# EAGLE design iGlass v2 (EAGLE 9.6.2)
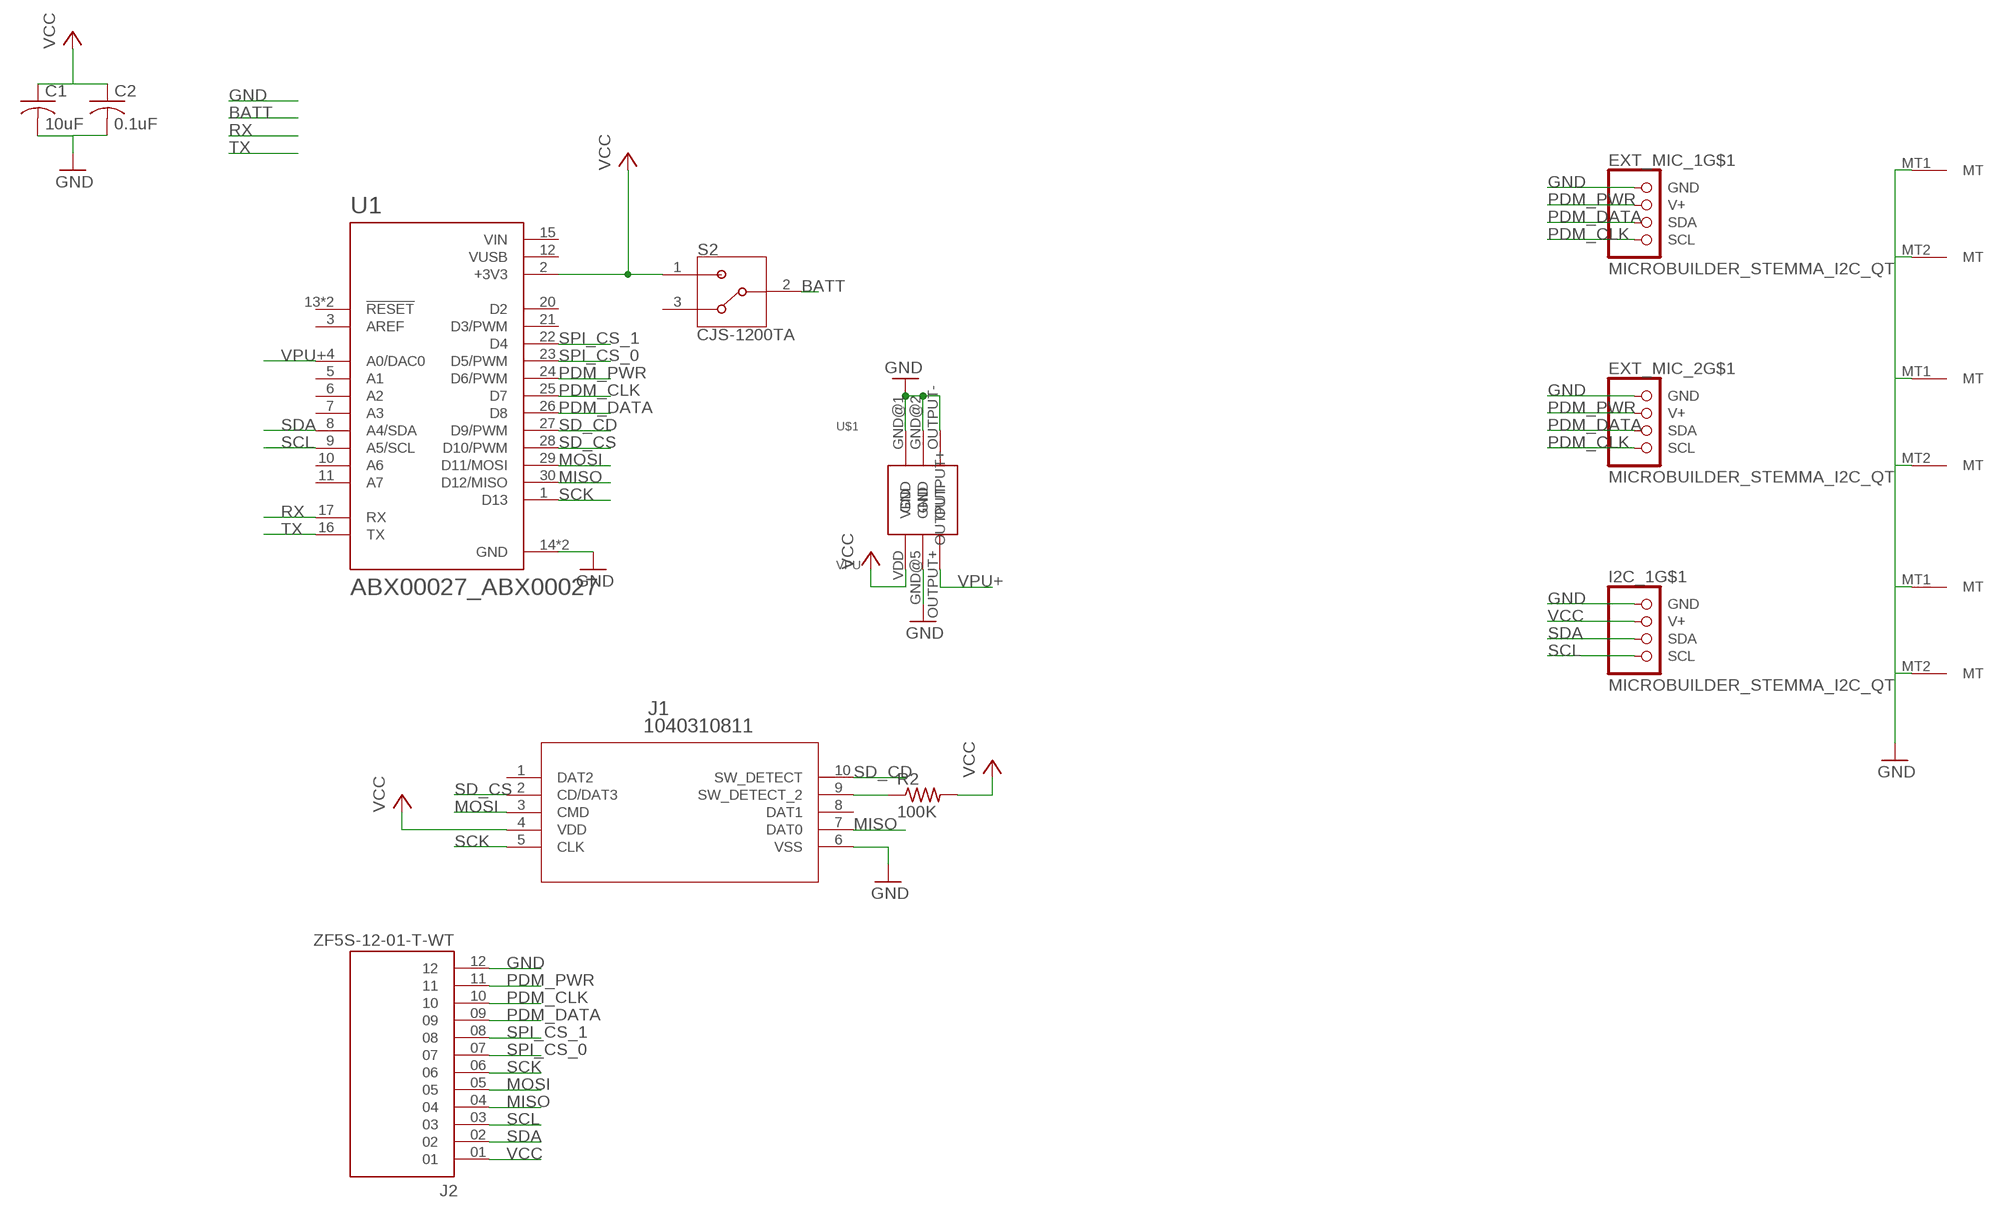
[diagram p0: schematic, sheet 1]

## Parts
C1  10uF  C-USC0805  [C0805]
C2  0.1uF  C-USC0805  [C0805]
EXT_MIC_1  MICROBUILDER_STEMMA_I2C_QT  [MICROBUILDER_JST_SH4]
EXT_MIC_2  MICROBUILDER_STEMMA_I2C_QT  [MICROBUILDER_JST_SH4]
I2C_1  MICROBUILDER_STEMMA_I2C_QT  [MICROBUILDER_JST_SH4]
J1  1040310811  [104031-0811_MOL]
J2  ZF5S-12-01-T-WT  [SAMTEC_ZF5S-12-01-T-WT]
R2  100K  R-US_R0805  [R0805]
S2  CJS-1200TA  [SW_CJS-1200TA]
U1  ABX00027_ABX00027  [ABX00027_MODULE_ABX00027]
U$1  VPU  [VPU]

## Nets
BATT: S2.2
GND: C1.2 C2.2 EXT_MIC_1.1(GND) EXT_MIC_1.MT1(MT) EXT_MIC_1.MT2(MT) EXT_MIC_2.1(GND) EXT_MIC_2.MT1(MT) EXT_MIC_2.MT2(MT) I2C_1.1(GND) I2C_1.MT1(MT) I2C_1.MT2(MT) J1.6(VSS) J2.12 U1.14(GND) U1.19(GND) U$1.GND@1(GND) U$1.GND@2(GND) U$1.GND@5(GND) U$1.OUTPUT-
MISO: J1.7(DAT0) J2.04 U1.30(D12/MISO)
MOSI: J1.3(CMD) J2.05 U1.29(D11/MOSI)
N$3: J1.9(SW_DETECT_2) R2.1
PDM_CLK: EXT_MIC_1.4(SCL) EXT_MIC_2.4(SCL) J2.10 U1.25(D7)
PDM_DATA: EXT_MIC_1.3(SDA) EXT_MIC_2.3(SDA) J2.09 U1.26(D8)
PDM_PWR: EXT_MIC_1.2(V+) EXT_MIC_2.2(V+) J2.11 U1.24(D6/PWM)
RX: U1.17(RX)
SCK: J1.5(CLK) J2.06 U1.1(D13)
SCL: I2C_1.4(SCL) J2.03 U1.9(A5/SCL)
SD_CD: J1.10(SW_DETECT) U1.27(D9/PWM)
SD_CS: J1.2(CD/DAT3) U1.28(D10/PWM)
SDA: I2C_1.3(SDA) J2.02 U1.8(A4/SDA)
SPI_CS_0: J2.07 U1.23(D5/PWM)
SPI_CS_1: J2.08 U1.22(D4)
TX: U1.16(TX)
VCC: C1.1 C2.1 I2C_1.2(V+) J1.4(VDD) J2.01 R2.2 S2.1 U1.2(+3V3) U$1.VDD
VPU+: U1.4(A0/DAC0) U$1.OUTPUT+
Unconnected: J1.1(DAT2) J1.8(DAT1) S2.3 U1.3(AREF) U1.5(A1) U1.6(A2) U1.7(A3) U1.10(A6) U1.11(A7) U1.13(!RESET) U1.18(!RESET) U1.20(D2) U1.21(D3/PWM)

## Power pins joined to a net without a drawn wire
VIN: U1.15(VIN)
VUSB: U1.12(VUSB)

## Library data of the parts
C1 C2 = rcl:C-US: CAPACITOR, American symbol
EXT_MIC_1 EXT_MIC_2 I2C_1 = smart-glasses:MICROBUILDER_STEMMA_I2C
J1 = micro_sd_slot:1040310811; COPYRIGHT: Copyright (C) 2021 Ultra Librarian. All rights reserved.; MANUFACTURER_PART_NUMBER: 1040310811; MFR_NAME: Molex Connector Corporation
J2 = ZF5S-12-01-T-WT:ZF5S-12-01-T-WT; MANUFACTURER: SAMTEC
R2 = resistor:R-US_: RESISTOR, American symbol
S2 = CJS-1200TA:CJS-1200TA: Switch Slide N.O./N.C. SPDT Raised Slide 0.1A 24VDC J-Hook SMD Embossed T/R Check availability <https://pricing.snapeda.com/parts/CJS-1200TA/Nidec%20Copal/view-part?ref=eda>; AVAILABILITY: In Stock; DESCRIPTION: Slide Switch SPDT Surface Mount; MF: Nidec Copal; MP: CJS-1200TA; PACKAGE: None; PRICE: None; PURCHASE-URL: https://pricing.snapeda.com/search/part/CJS-1200TA/?ref=eda
U1 = smart-glasses:ABX00027_ABX00027: ATSAMD21G18A Arduino Nano 33 IoT SAM D ARM® Cortex®-M0+ MCU 32-Bit Embedded Evaluation Board Check prices <https://pricing.snapeda.com/parts/ABX00027/Arduino/view-part?ref=eda>; AVAILABILITY: In Stock; DESCRIPTION: ATSAMD21G18A Arduino Nano 33 IoT SAM D ARM® Cortex®-M0+ MCU 32-Bit Embedded Evaluation Board; MF: Arduino; MP: ABX00027; PACKAGE: None; PRICE: None; PURCHASE-URL: https://pricing.snapeda.com/search/part/ABX00027/?ref=eda
U$1 = VPU:VPU

## Board
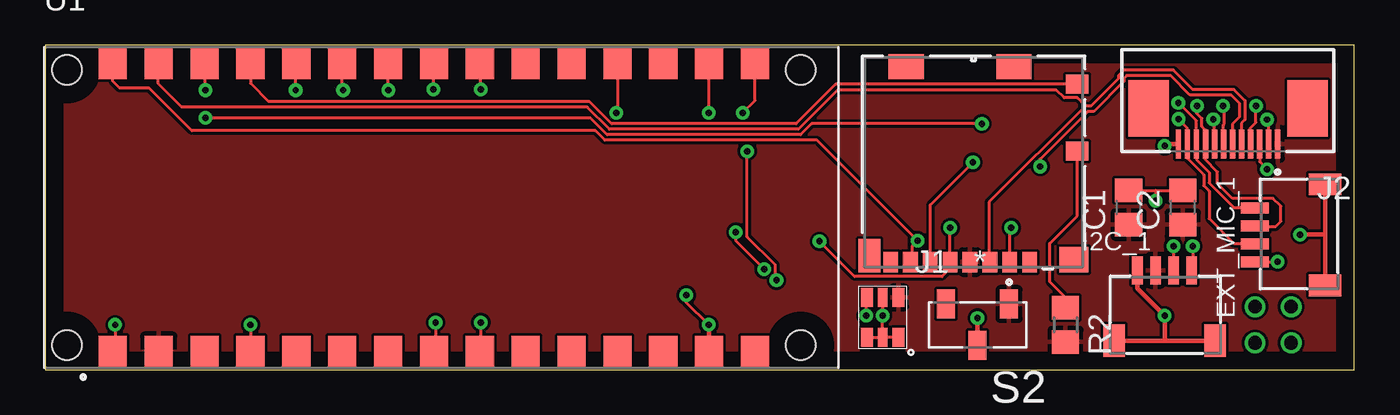
[diagram p1: board, top side]
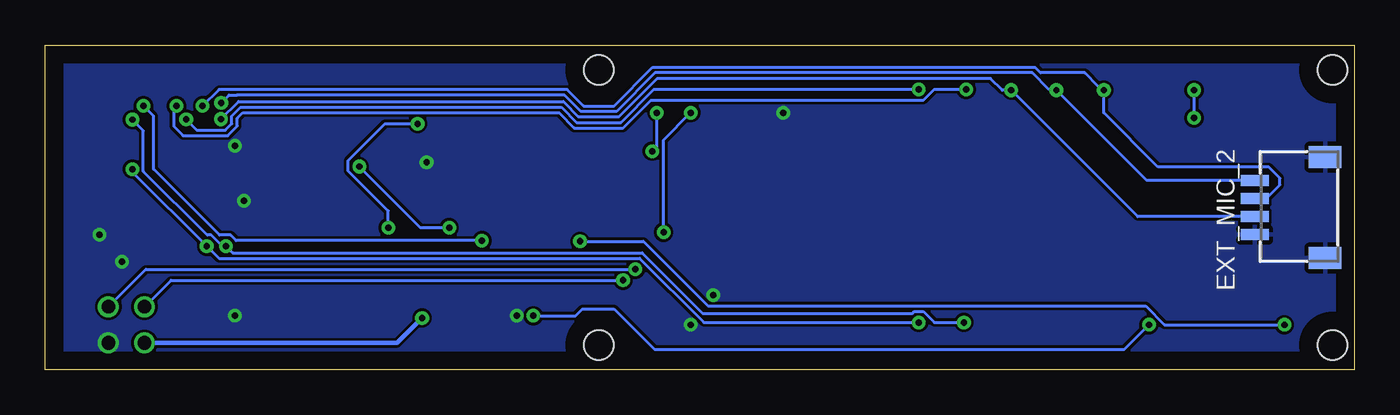
[diagram p2: board, bottom side, seen from below]

Size 72.5 x 18 mm. Coordinates in mm from the lower left corner, seen from the top.
Outline: 0,0 72.5,0 72.5,18 0,18 0,0
Copper layers (1*16): Top 0.035mm / dielectric 1.5mm / Bottom 0.035mm
Design rules "default": minimum track width 6mil, minimum drill 0.35mm, track to track 6mil, track to pad 6mil, pad to pad 6mil, via to via 6mil, smd to smd 6mil, copper to edge 40mil, drill to drill 6mil, minimum pad ring 10mil, minimum via ring 8mil, stop-mask expansion 4mil, vias tented up to drill 0mil, thermal gap 10mil

### Footprints (pad centres in the part's own frame; a part is rotated, then mirrored left to right if it is on the bottom)
C0805 = smd 1.3 x 1.5: 1 -0.95,0; 2 0.95,0
MICROBUILDER_JST_SH4 = smd 0.6 x 1.55: 1 -1.5,2.514; 2 -0.5,2.514; 3 0.5,2.514; 4 1.5,2.514 | smd 1.2 x 1.8: MT1 -2.8,-1.386; MT2 2.8,-1.386
104031-0811_MOL = smd 0.813 x 1.143: 1 3.105,-5.521; 2 2.005,-5.521; 3 0.905,-5.521; 4 -0.195,-5.521; 5 -1.295,-5.521; 6 -2.395,-5.521; 7 -3.495,-5.521; 8 -4.595,-5.521 | smd 1.245 x 1.041: 9 5.74,0.628; 10 5.74,4.329 | smd 1.6 x 1.397: 11 5.565,-5.396 | smd 1.219 x 1.854: 12 -5.755,-5.171 | smd 1.956 x 1.397: 13 -3.73,5.303; 14 2.24,5.303
SAMTEC_ZF5S-12-01-T-WT = smd 0.3 x 1.6: 01 -2.75,1.98; 02 -2.25,1.98; 03 -1.75,1.98; 04 -1.25,1.98; 05 -0.75,1.98; 06 -0.25,1.98; 07 0.25,1.98; 08 0.75,1.98; 09 1.25,1.98; 10 1.75,1.98; 11 2.25,1.98; 12 2.75,1.98 | smd 2.24 x 3.12: S1 -4.397,0; S2 4.397,0
R0805 = smd 1.3 x 1.5: 1 -0.95,0; 2 0.95,0
SW_CJS-1200TA = smd 1 x 1.6: 1 -1.75,-1.15; 2 0,1.15; 3 1.75,-1.15
ABX00027_MODULE_ABX00027 = smd 1.56 x 1.75: 1 -18.19,-8; 2 -15.65,-8; 3 -13.11,-8; 4 -10.57,-8; 5 -8.03,-8; 6 -5.49,-8; 7 -2.95,-8; 8 -0.41,-8; 9 2.13,-8; 10 4.67,-8; 11 7.21,-8; 12 9.75,-8; 13 12.29,-8; 14 14.83,-8; 15 17.37,-8; 16 17.37,8; 17 14.83,8; 18 12.29,8; 19 9.75,8; 20 7.21,8; 21 4.67,8; 22 2.13,8; 23 -0.41,8; 24 -2.95,8; 25 -5.49,8; 26 -8.03,8; 27 -10.57,8; 28 -13.11,8; 29 -15.65,8; 30 -18.19,8 | hole 1.651: -20.73,-7.62; -20.73,7.62; 19.91,7.62; 19.91,-7.62
VPU = smd 0.662 x 1.03: GND@1 -0.884,1.105; OUTPUT+ 0.884,-1.105; OUTPUT- 0.884,1.105; VDD -0.884,-1.105 | smd 0.533 x 1.03: GND@2 0,1.105; GND@5 0,-1.105

### Placement (x,y rotation side)
C1  60,9 90 top
C2  63,9 90 top
EXT_MIC_1  69.5,7.48 90 top
EXT_MIC_2  3,9 90 bottom
I2C_1  61.99,3 0 top
J1  51.41,11.5 0 top
J2  65.5,14.5 180 top
R2  56.5,2.5 270 top
S2  51.63,2.5 180 top
U1  21.94,9 0 top
U$1  46.38,2.91 180 top

### Tracks (layer width: path | path; a pad name or v marks a point on that pad's centre or on a via)
BATT  (via drill 0.35, 0.75)
  Top 0.254: v51.62,2.88 S2.2
  Bottom 0.254: v67,1.5 53,1.5 v51.62,2.88
GND  (via drill 0.35, 0.75)
  Top 0.152: C1.2 61.5,9.95 | 61.5,9.95 C2.2 | 61.5,9.95 v61.5,9.38 | J1.6 49.02,9.14 v51.38,11.5 | U1.19 31.69,14.31 v31.62,14.25 | U$1.GND@5 v46.38,3 | v46.38,3 | U$1.OUTPUT- U$1.GND@2 | U$1.GND@1 U$1.GND@2 | U$1.GND@2 v46.38,3 | v36.75,2.5 35.5,3.75 v35.5,4.14 | EXT_MIC_1.1 68.23,5.98 v68.25,6
  Top 0.254: U1.14 36.77,2.48 v36.75,2.5 | I2C_1.MT1 62.12,1.61 | 62.12,1.61 I2C_1.MT2 | 62.12,1.61 62,1.74 v62,3 60.49,4.51 I2C_1.1 | EXT_MIC_1.MT2 70.89,7.5 | 70.89,7.5 EXT_MIC_1.MT1 | 70.89,7.5 v69.5,7.5 | J2.12 62.11,12.52 v62,12.41
  other vias: 69,1.5
  pour Bottom: -0.5,18.5 -0.5,-0.5 73,-0.5 73,18.5
MISO  (via drill 0.35)
  Top 0.152: v67.06,14.63 67.06,13.72 66.75,13.41 66.75,12.65 J2.04 | J1.7 48.01,6.1 48.01,6.86 v48.31,7.16 42.74,12.73 31,12.73 30.47,13.25 8.12,13.25 5.75,15.62 4.12,15.62 3.75,16 3.75,16.91
  Bottom 0.152: v67.06,14.63 66.5,14.07 66.5,11.12 62.84,7.46 62.23,7.46 61.93,7.16 v48.31,7.16
MOSI
  Top 0.152: 57.61,14.63 52.27,9.3 52.27,6.1 J1.3 | 57.61,14.63 57.91,14.63 59.44,16.15 59.44,16.31 59.74,16.61 62.48,16.61 63.55,15.54 65.84,15.54 66.45,14.94 66.45,13.87 66.25,13.67 J2.05 66.29,12.65 | 57.61,14.63 57.16,15.08 56.43,15.08 56.01,15.5 43.87,15.5 41.71,13.34 31.25,13.34 30.02,14.57 7.55,14.57 6.25,15.88 6.25,16.87 6.29,16.91
N$3
  Top 0.152: J1.9 57.15,8.53 55.63,7.01 55.63,4.88 56.39,4.12 56.39,3.5 R2.1
PDM_CLK  (via drill 0.35)
  Top 0.152: v16.5,15.5 16.45,15.55 16.45,16.91 | EXT_MIC_1.4 66.9,8.99 65.84,8.99 64.47,10.36 64.47,10.95 63.75,11.66 J2.10 63.75,13.81 v62.75,14.8
  Bottom 0.152: EXT_MIC_2.4 11.5,10.5 v16.5,15.5 16.61,15.54 16.92,15.54 17.83,16.46 38.73,16.46 40.87,14.33 42.82,14.33 43.74,15.24 61.88,15.24 62.32,15.24 v62.75,14.8
PDM_DATA  (via drill 0.35)
  Top 0.152: v13.88,15.5 13.88,16.87 13.91,16.91 | EXT_MIC_1.3 67.06,7.92 68.12,7.92 68.43,8.23 68.43,9.07 67.99,9.51 65.75,9.51 64.92,10.34 64.92,10.97 64.25,11.64 J2.09 | 64.31,12.5 J2.09 | J2.09 64.25,13.29 64.06,13.49 64.06,13.93 63.78,14.21 v63.78,14.63
  Bottom 0.152: EXT_MIC_2.3 4.88,9.5 4.12,10.25 4.12,10.62 4.75,11.25 10.88,11.25 13.88,14.25 v13.88,15.5 13.87,15.54 14.02,15.7 14.17,15.7 14.94,16.46 17.37,16.46 17.68,16.76 38.86,16.76 40.99,14.63 42.67,14.63 43.59,15.54 62.87,15.54 v63.78,14.63
PDM_PWR  (via drill 0.35)
  Top 0.152: v19,15.5 19,16.9 18.99,16.91 | EXT_MIC_1.2 66.9,7.01 65.84,7.01 64.47,8.38 64.47,9.91 64.16,10.21 64.16,10.82 63.25,11.73 63.25,12.5 J2.11 63.25,13.41 v62.77,13.89
  Bottom 0.152: EXT_MIC_2.2 12,8.5 v19,15.5 19.5,15.5 20.15,16.15 38.61,16.15 40.74,14.02 42.95,14.02 43.8,14.88 61.79,14.88 v62.77,13.89
RX  (via drill 0.35, 0.75)
  Top 0.152: v39.82,5.57 38.25,7.15 v38.25,7.62 | v36.75,14.25 36.75,16.89 36.77,16.91
  Bottom 0.152: v69,3.5 66.93,5.57 v39.82,5.57 | v38.25,7.62 38.25,12.75 v36.75,14.25
SCK  (via drill 0.35)
  Top 0.152: 65.84,12.65 J2.06 65.75,13.63 66.14,14.02 66.14,14.78 65.68,15.24 63.4,15.24 62.33,16.31 59.89,16.31 59.74,16.15 59.74,16 58.06,14.33 57.73,14.33 55.1,11.7 v55.1,11.27 | v50.12,7.88 50.12,7.87 J1.5 50.12,5.62 49.67,5.17 44.83,5.17 v42.88,7.12 | v3.88,2.5 3.88,1.22 3.75,1.09
  Bottom 0.152: v50.12,7.88 51.71,7.88 v55.1,11.27 | v42.88,7.12 39.38,7.12 35.79,3.54 11.55,3.54 10.52,2.5 v3.88,2.5
SCL  (via drill 0.35)
  Top 0.152: v63.55,6.86 63.55,5.64 I2C_1.4 | 67.21,12.5 J2.03 67.25,11.54 v67.67,11.12 | v24.12,2.62 24.12,1.15 24.07,1.09
  Bottom 0.152: v67.67,11.12 67.67,10.97 v63.55,6.86 62.87,6.18 39.57,6.18 36.02,2.62 v24.12,2.62
SD_CD
  Top 0.152: J1.10 43.77,15.83 41.59,13.64 31.37,13.64 30.14,14.88 12.38,14.88 11.37,15.88 U1.27
SD_CS  (via drill 0.35)
  Top 0.152: J1.2 53.41,7.79 v53.5,7.88 | v8.88,15.5 8.88,16.86 8.83,16.91 | v8.88,13.96 30.19,13.96 31.12,13.03 41.84,13.03 42.45,13.64 v51.88,13.64
  Bottom 0.152: v53.5,7.88 53.5,8.81 55.71,11.02 55.71,11.61 53.68,13.64 v51.88,13.64 | v8.88,13.96 v8.88,15.5
SDA  (via drill 0.35)
  Top 0.152: v62.48,6.86 62.48,5.64 I2C_1.3 | J2.02 67.75,13.78 v67.67,13.87 | v21.62,2.62 21.62,1.19 21.53,1.09
  Bottom 0.152: v67.67,13.87 67.06,13.26 67.06,11 63.52,7.46 63.3,7.46 62.69,6.86 v62.48,6.86 62.11,6.49 39.45,6.49 36.09,3.12 24.48,3.12 24.38,3.23 23.87,3.23 23.27,2.62 v21.62,2.62
SPI_CS_0  (via drill 0.35)
  Top 0.152: v21.5,15.55 21.5,16.88 21.53,16.91 | J2.07 65.25,13.58 65.3,13.63 65.3,14.56 v65.23,14.63
  Bottom 0.152: v21.5,15.55 23.27,15.55 23.87,14.94 38.96,14.94 40.49,13.41 43.2,13.41 44.04,14.25 61.55,14.25 61.86,13.94 61.86,13.52 62.39,12.98 64.86,12.98 65.38,13.5 65.38,14.48 v65.23,14.63
SPI_CS_1  (via drill 0.35)
  Top 0.152: J2.08 64.75,13.82 v64.69,13.88 | 24.07,16.91 24.12,16.85 v24.12,15.55
  Bottom 0.152: v64.69,13.88 64.09,13.29 62.52,13.29 62.16,13.64 62.16,14.07 61.68,14.55 43.91,14.55 43.08,13.72 40.62,13.72 38.78,15.55 v24.12,15.55
TX  (via drill 0.35, 0.75)
  Top 0.152: v40.5,4.97 40.43,5.04 40.43,5.82 38.88,7.38 v38.88,12.12 | v38.62,14.25 39.31,14.94 39.31,16.91
  Bottom 0.152: v67,3.5 65.53,4.97 v40.5,4.97 | v38.88,12.12 38.62,12.37 v38.62,14.25
VCC
  Top 0.152: J1.4 51.21,5.94 51.21,5.9
  pour Top: -0.5,18.5 -0.5,-0.5 73,-0.5 73,18.5
VPU+  (via drill 0.35)
  Top 0.152: U$1.OUTPUT+ 45.47,3.98 v45.47,3 | v11.38,2.5 11.38,1.1 11.37,1.09
  Bottom 0.152: v45.47,3 43.12,3 42.75,3.38 41,3.38 38.77,1.14 12.73,1.14 v11.38,2.5